# Altium project esp32_wled.PrjPcb
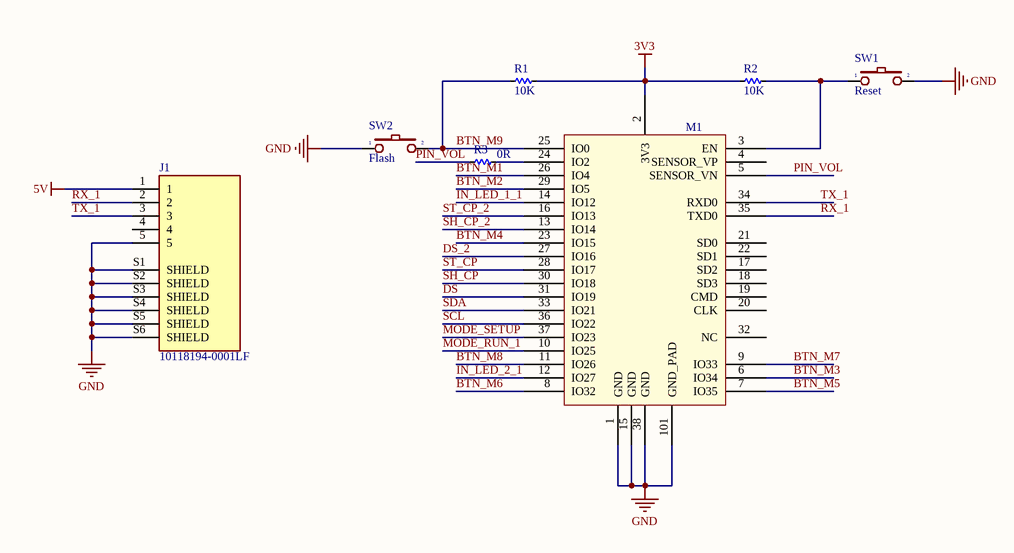
[diagram p0: [1]esp32.SchDoc]
5 sheets, 95 parts. Net scope: global (net labels, ports and power ports of the same name join across sheets).
Board file: esp32_wled.PcbDoc
Sheets:
  [1]esp32.SchDoc
  [2]Power.SchDoc
  [3]mic.SchDoc
  [4]Communicate.SchDoc
  [5]wled.SchDoc

## Sheet [1]esp32.SchDoc
size A4

### Parts
J1  10118194-0001LF  [AMPHENOL_10118194-0001LF]
M1  ESP32S_Module  [ESP32S]  (value not drawn)
R1  10K  [RES-SMD-0603]
R2  10K  [RES-SMD-0603]
R3  0R  [RES-SMD-0603]
SW1  Reset  [SW1-SMD]
SW2  Flash  [SW-DIP1-1]

### Nets
3V3: M1.2(3V3) R1.1 R2.2
5V: J1.1
GND: J1.5 J1.S1(SHIELD) J1.S2(SHIELD) J1.S3(SHIELD) J1.S4(SHIELD) J1.S5(SHIELD) J1.S6(SHIELD) M1.1(GND) M1.15(GND) M1.38(GND) M1.101(GND_PAD) SW1.2 SW2.1
BTN_M1: M1.26(IO4)
BTN_M2: M1.29(IO5)
BTN_M3: M1.6(IO34)
BTN_M4: M1.23(IO15)
BTN_M5: M1.7(IO35)
BTN_M6: M1.8(IO32)
BTN_M7: M1.9(IO33)
BTN_M8: M1.11(IO26)
BTN_M9: M1.25(IO0) R1.2 SW2.2
DS: M1.31(IO19)
DS_2: M1.27(IO16)
IN_LED_1_1: M1.14(IO12)
IN_LED_2_1: M1.12(IO27)
MODE_RUN_1: M1.10(IO25)
MODE_SETUP: M1.37(IO23)
PIN_VOL: M1.5(SENSOR_VN) R3.1
RX_1: J1.2 M1.35(TXD0)
SCL: M1.36(IO22)
SDA: M1.33(IO21)
SH_CP: M1.30(IO18)
SH_CP_2: M1.13(IO14)
ST_CP: M1.28(IO17)
ST_CP_2: M1.16(IO13)
TX_1: J1.3 M1.34(RXD0)
NetM1_3: M1.3(EN) R2.1 SW1.1
NetM1_24: M1.24(IO2) R3.2

Not connected (* = marked no-connect by the designer): J1 4; M1 4(SENSOR_VP) 17(SD2) 18(SD3) 19(CMD) 20(CLK) 21(SD0) 22(SD1) 32(NC)

### Library data of the parts
J1 = 10118194-0001LF: USB - micro B USB 2.0 Receptacle Connector 5 Position Surface Mount, Right Angle; Through Hole; MF: Amphenol ICC; Package: None; Price: None; Availability: Unavailable; MP: 10118194-0001LF; SnapEDA_Link: https://www.snapeda.com/parts/10118194-0001LF/Amphenol%20FCI/view-part/1413308/?ref=snap; Value: *
M1 = ESP32S_Module: Esp-32S; Datasheet: https://espressif.com/sites/default/files/documentation/esp_wroom_32_datasheet_en.pdf
R1-R3 = Res-SMD: Resistor; Manufacturer: Generic Components; Class: Passive; Published: 08/06/2000; Publisher: Altium Hobart Technology Centre
SW1 SW2 = SW2: Switch button 2 pin; Value: SW chip 2 pin

## Sheet [2]Power.SchDoc
size A
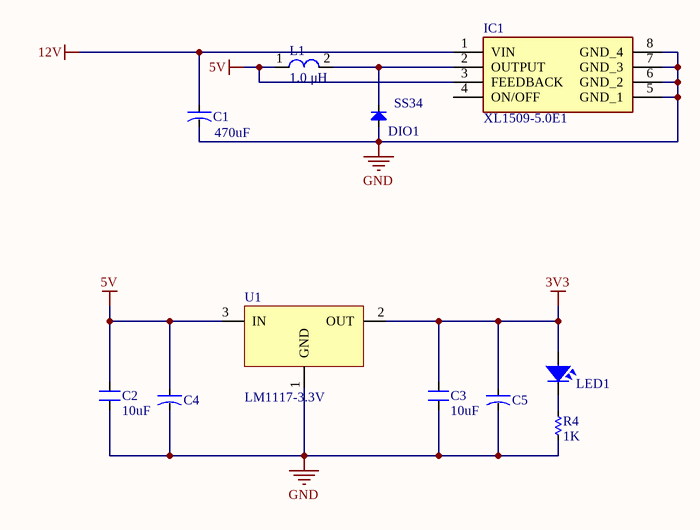
[diagram p1: [2]Power.SchDoc]

### Parts
C1  470uF  [CAP-ALU-SMD-6.3x7.7x2.2]
C2  10uF  [CN-SMD-0603]
C3  10uF  [CN-SMD-0603]
C4  CN-ALU-SMD  [CAP-ALU-SMD-4.5x5x1.4]  (value not drawn)
C5  CN-ALU-SMD  [CAP-ALU-SMD-4.5x5x1.4]  (value not drawn)
DIO1  SS34  [DIO-SMD-106]
IC1  XL1509-5.0E1  [SOIC127P600X175-8N]
L1  1.0 μH  [L-SMD-M-7.3x4.5]
LED1  LED  [LED-0805-Blue]  (value not drawn)
R4  1K  [RES-SMD-0603]
U1  LM1117-3.3V  [SOT223]

### Nets
3V3: C3.1 C5.1 LED1.1 U1.2(OUT)
5V: C2.1 C4.1 IC1.3(FEEDBACK) L1.1 U1.3(IN)
12V: C1.1 IC1.1(VIN)
GND: C1.2 C2.2 C3.2 C4.2 C5.2 DIO1.1(A) IC1.5(GND_1) IC1.6(GND_2) IC1.7(GND_3) IC1.8(GND_4) R4.2 U1.1(GND)
NetDIO1_2: DIO1.2(K) IC1.2(OUTPUT) L1.2
NetLED1_2: LED1.2 R4.1

Not connected (* = marked no-connect by the designer): IC1 4(ON/OFF)

### Library data of the parts
C1 C4 C5 = CN-ALU-SMD: Polarized Capacitor (Axial); Published: 8-Jun-2000; LatestRevisionDate: 17-Jul-2002; LatestRevisionNote: Re-released for DXP Platform.; PackageReference: POLAR0.8; Publisher: Altium Limited
C2 C3 = CN: Tu gom; Value: 33pF
DIO1 = Diode SMD: Default Diode; Code - JEDEC: DO-214-AB; Value: 1N5007; Published: 8-Jun-2000; Revision: July-2002: Re-released for DXP Platform.; Publisher: Altium Limited
IC1 = XL1509-5.0E1: Integrated Circuit; Manufacturer_Name: XLSEMI; Datasheet Link: https://datasheet.lcsc.com/szlcsc/XLSEMI-XL1509-5-0E1_C61063.pdf; Height: 1.75mm; Manufacturer_Part_Number: XL1509-5.0E1
L1 = L-SMD-1: partNo: 78477010; Manufacturer: Wurth Elektronik; Inductance: 1.0 μH; ComponentLink1Description: Manufacturer; ComponentLink1URL: http://www.we-online.de; Created by: Baojun Chen; Created Date: Nov.2015; ComponentLink2Description: Datasheet; ComponentLink2URL: http://katalog.we-online.de/pbs/datasheet/78477010.pdf
LED1 = LED SMD: Value: LED 3 - 5 ly 2 Colour
R4 = Res-SMD: as R1 on sheet [1]esp32; Published: 08/06/2000; Publisher: Altium Hobart Technology Centre
U1 = LM1117: 800mA Low-Dropout Linear Regulator; Creator: Nguyen Ba Bien; Website: http://group3i.net

## Sheet [3]mic.SchDoc
size A
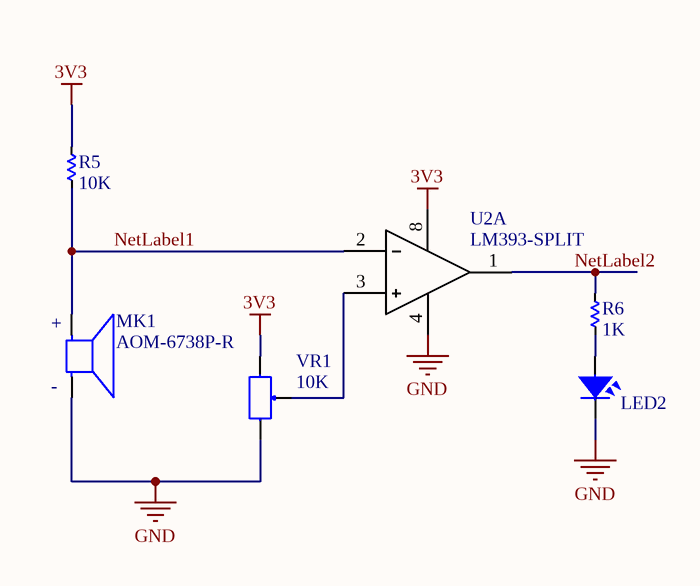
[diagram p2: [3]mic.SchDoc]

### Parts
LED2  LED  [LED-0805-Green]  (value not drawn)
MK1  AOM-6738P-R  [MIC_AOM-6738P-R]
R5  10K  [RES-SMD-0805]
R6  1K  [RES-SMD-0805]
U2  LM393-SPLIT  [SO8]  (part A of 2)
VR1  10K  [VR]

### Nets
3V3: R5.1 U2.8(Vcc+) VR1.1
GND: LED2.2 MK1.N(NEG) U2.4(Vcc-) VR1.3
NetLabel1: MK1.P(POS) R5.2 U2.2
NetLabel2: R6.1 U2.1
NetLED2_1: LED2.1 R6.2
NetU2_3: U2.3 VR1.2

### Notes on the sheet
- (in symbol AOM-6738P-R) +; -

### Library data of the parts
LED2 = LED SMD: Value: LED 3 - 5 ly 2 Colour
MK1 = AOM-6738P-R: MICROPHONE -38DB1.5VDC .5MA 2.2KOHM; MF: PUI; MP: AOM-6738P-R; SnapEDA_Link: https://www.snapeda.com/parts/AOM-6738P-R/PUI+Audio%252C+Inc./view-part/?ref=snap; Purchase-URL: https://pricing.snapeda.com/search/part/AOM-6738P-R/?ref=eda; Value: *; Package: None; Price: None; Availability: In Stock; Check_prices: https://www.snapeda.com/parts/AOM-6738P-R/PUI+Audio%252C+Inc./view-part/?ref=eda
R5 R6 = Res-SMD: as R1 on sheet [1]esp32; Published: 08/06/2000; Publisher: Altium Hobart Technology Centre
U2 = LM393-SPLIT: IC DUAL COMPARATOR; Supplier 1: Digi-Key; Supplier Part Number 1: LM393MXFSDKR-ND
VR1 = VR: Var Resistor; Value: VR 10K

## Sheet [4]Communicate.SchDoc
size A
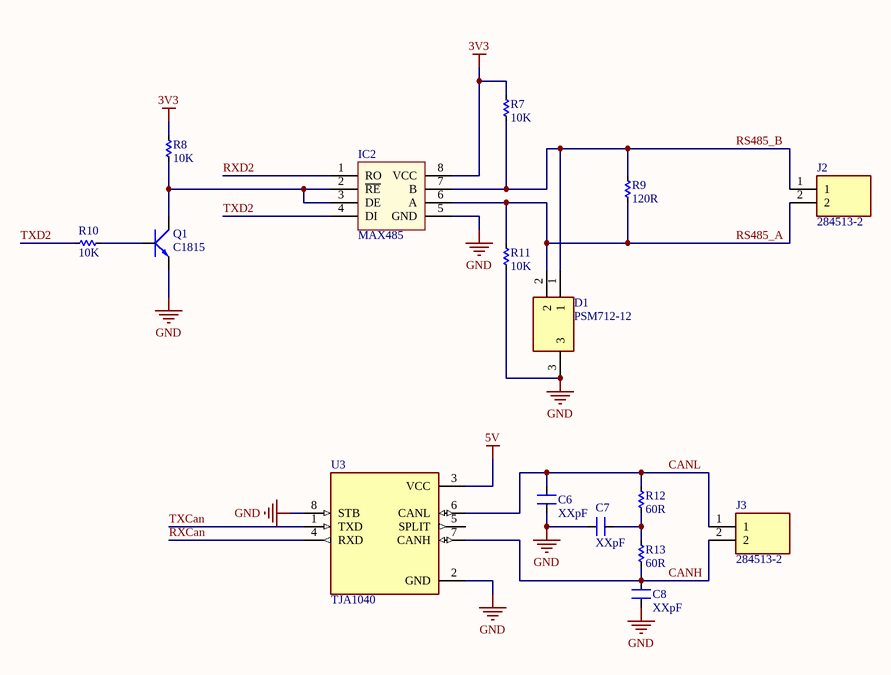
[diagram p3: [4]Communicate.SchDoc]

### Parts
C6  XXpF  [CN-SMD-0805]
C7  XXpF  [CN-SMD-0805]
C8  XXpF  [CN-SMD-0805]
D1  PSM712-12  [PSM71212]
IC2  MAX485  [SO8]
J2  284513-2  [SHDRRA2W80P0X381_1X2_863X920X730P]
J3  284513-2  [SHDRRA2W80P0X381_1X2_863X920X730P]
Q1  C1815  [SOT23B]
R7  10K  [RES-SMD-0805]
R8  10K  [RES-SMD-0805]
R9  120R  [RES-SMD-0805]
R10  10K  [RES-SMD-0805]
R11  10K  [RES-SMD-0805]
R12  60R  [RES-SMD-0805]
R13  60R  [RES-SMD-0805]
U3  TJA1040  [SOIC127P600X175-8N]

### Nets
3V3: IC2.8(VCC) R7.2 R8.2
5V: U3.3(VCC)
GND: C6.1 C7.1 C8.1 D1.3 IC2.5(GND) Q1.1(E) R11.1 U3.2(GND) U3.8(STB)
CANH: C8.2 J3.2 R13.2 U3.7(CANH)
CANL: C6.2 J3.1 R12.1 U3.6(CANL)
RS485_A: D1.2 IC2.6(A) J2.2 R9.1 R11.2
RS485_B: D1.1 IC2.7(B) J2.1 R7.1 R9.2
RXCan: U3.4(RXD)
RXD2: IC2.1(RO)
TXCan: U3.1(TXD)
TXD2: IC2.4(DI) R10.1
NetC7_2: C7.2 R12.2 R13.1
NetIC2_2: IC2.2(~{RE}) IC2.3(DE) Q1.2(C) R8.1
NetQ1_3: Q1.3(B) R10.2

Not connected (* = marked no-connect by the designer): U3 5(SPLIT)

### Library data of the parts
C6-C8 = CN: Value: 33pF
D1 = PSM712-12: TVS Diode (Bi-directional); Manufacturer_Name: ProTek Devices; Datasheet Link: http://www.protekdevices.com/xyz/documents/datasheets/psm712.pdf; Height: 1.21mm; Manufacturer_Part_Number: PSM712-12
IC2 = MAX485: RS232 - RS485 (Same sn75176)
J2 J3 = 284513-2: Connector; Manufacturer_Name: TE Connectivity; Datasheet Link: https://www.te.com/commerce/DocumentDelivery/DDEController?Action=showdoc&DocId=Catalog+Section%7F1308389_EUROSTYLE_TERMINAL_BLOCKS%7F0607%7Fpdf%7FEnglish%7FENG_CS_1308389_EUROSTYLE_TERMINAL_BLOCKS_0607.pdf%7F284513-2; Height: 7.3mm; Manufacturer_Part_Number: 284513-2; Mouser Part Number: 571-284513-2; Mouser Price/Stock: https://www.mouser.co.uk/ProductDetail/TE-Connectivity/284513-2?qs=woBvfblj%2FzzKKzHe5cbw%252BQ%3D%3D; Arrow Part Number: 284513-2; Arrow Price/Stock: https://www.arrow.com/en/products/284513-2/te-connectivity
Q1 = C1815: NPN 600mW, ECB; Value: C1815
R7-R13 = Res-SMD: as R1 on sheet [1]esp32; Published: 08/06/2000; Publisher: Altium Hobart Technology Centre
U3 = TJA1040: 1/1 Transceiver Half CANbus 8-SO; MF: NXP USA; Package: SOIC-8 NXP USA; SnapEDA_Link: https://www.snapeda.com/parts/TJA1040/NXP%20USA%20Inc./view-part/563351/?ref=snap; Price: None; Availability: Unavailable; MP: TJA1040; Value: *

## Sheet [5]wled.SchDoc
size A
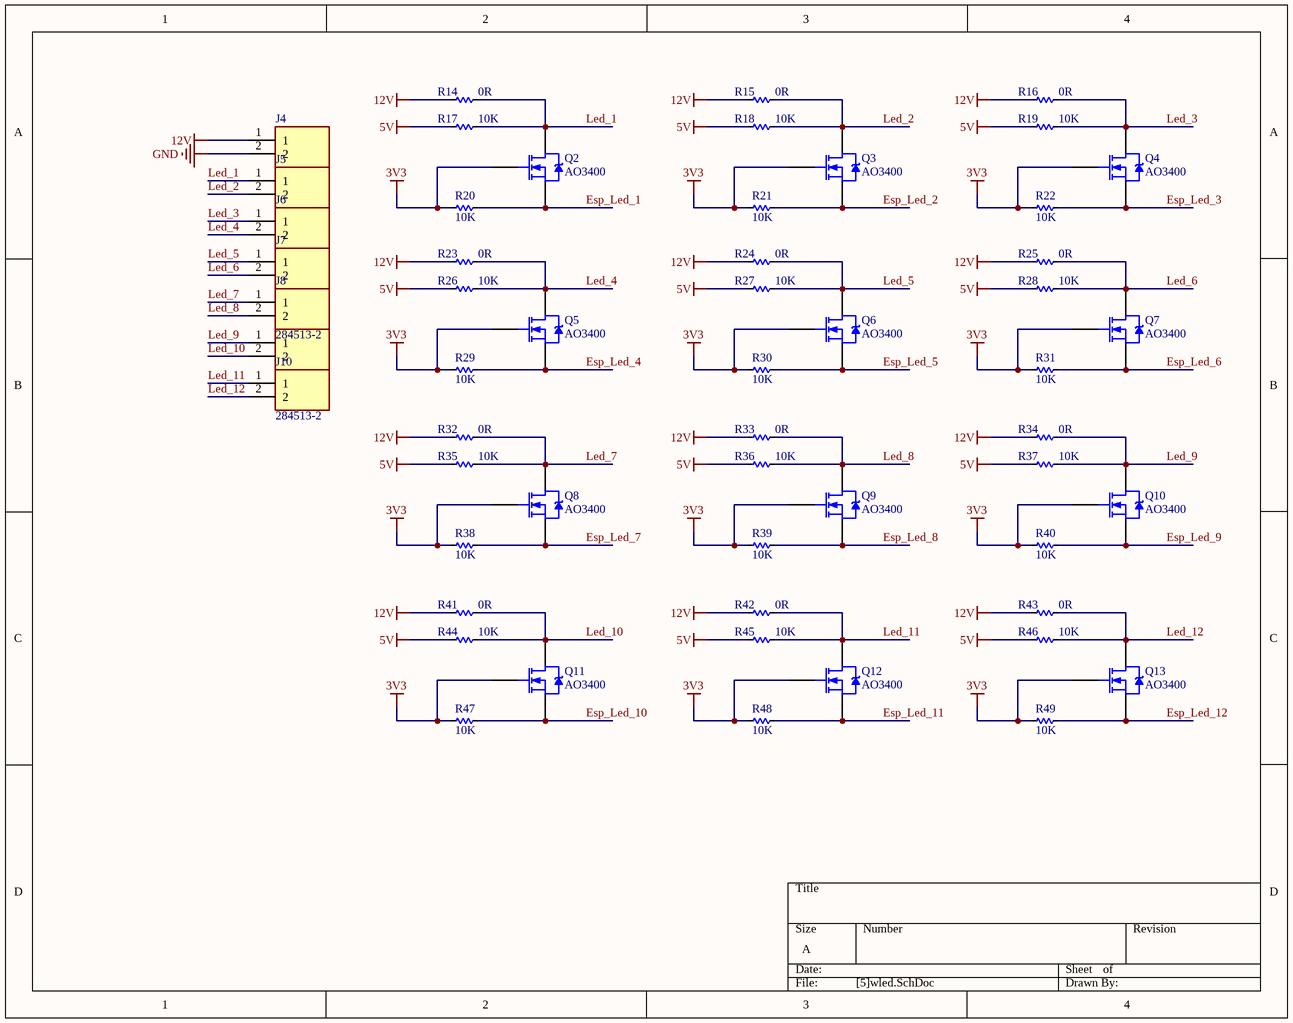
[diagram p4: [5]wled.SchDoc]

### Parts
J4  284513-2  [SHDRRA2W80P0X381_1X2_863X920X730P]
J5  284513-2  [SHDRRA2W80P0X381_1X2_863X920X730P]
J6  284513-2  [SHDRRA2W80P0X381_1X2_863X920X730P]
J7  284513-2  [SHDRRA2W80P0X381_1X2_863X920X730P]
J8  284513-2  [SHDRRA2W80P0X381_1X2_863X920X730P]
J9  284513-2  [SHDRRA2W80P0X381_1X2_863X920X730P]
J10  284513-2  [SHDRRA2W80P0X381_1X2_863X920X730P]
Q2  AO3400  [SOT-23_N]
Q3  AO3400  [SOT-23_N]
Q4  AO3400  [SOT-23_N]
Q5  AO3400  [SOT-23_N]
Q6  AO3400  [SOT-23_N]
Q7  AO3400  [SOT-23_N]
Q8  AO3400  [SOT-23_N]
Q9  AO3400  [SOT-23_N]
Q10  AO3400  [SOT-23_N]
Q11  AO3400  [SOT-23_N]
Q12  AO3400  [SOT-23_N]
Q13  AO3400  [SOT-23_N]
R14  0R  [RES-SMD-0805]
R15  0R  [RES-SMD-0805]
R16  0R  [RES-SMD-0805]
R17  10K  [RES-SMD-0805]
R18  10K  [RES-SMD-0805]
R19  10K  [RES-SMD-0805]
R20  10K  [RES-SMD-0805]
R21  10K  [RES-SMD-0805]
R22  10K  [RES-SMD-0805]
R23  0R  [RES-SMD-0805]
R24  0R  [RES-SMD-0805]
R25  0R  [RES-SMD-0805]
R26  10K  [RES-SMD-0805]
R27  10K  [RES-SMD-0805]
R28  10K  [RES-SMD-0805]
R29  10K  [RES-SMD-0805]
R30  10K  [RES-SMD-0805]
R31  10K  [RES-SMD-0805]
R32  0R  [RES-SMD-0805]
R33  0R  [RES-SMD-0805]
R34  0R  [RES-SMD-0805]
R35  10K  [RES-SMD-0805]
R36  10K  [RES-SMD-0805]
R37  10K  [RES-SMD-0805]
R38  10K  [RES-SMD-0805]
R39  10K  [RES-SMD-0805]
R40  10K  [RES-SMD-0805]
R41  0R  [RES-SMD-0805]
R42  0R  [RES-SMD-0805]
R43  0R  [RES-SMD-0805]
R44  10K  [RES-SMD-0805]
R45  10K  [RES-SMD-0805]
R46  10K  [RES-SMD-0805]
R47  10K  [RES-SMD-0805]
R48  10K  [RES-SMD-0805]
R49  10K  [RES-SMD-0805]

### Nets
3V3: Q2.1(G) Q3.1(G) Q4.1(G) Q5.1(G) Q6.1(G) Q7.1(G) Q8.1(G) Q9.1(G) Q10.1(G) Q11.1(G) Q12.1(G) Q13.1(G) R20.1 R21.1 R22.1 R29.1 R30.1 R31.1 R38.1 R39.1 R40.1 R47.1 R48.1 R49.1
5V: R17.1 R18.1 R19.1 R26.1 R27.1 R28.1 R35.1 R36.1 R37.1 R44.1 R45.1 R46.1
12V: J4.1 R14.1 R15.1 R16.1 R23.1 R24.1 R25.1 R32.1 R33.1 R34.1 R41.1 R42.1 R43.1
GND: J4.2
Esp_Led_1: Q2.2(S) R20.2
Esp_Led_2: Q3.2(S) R21.2
Esp_Led_3: Q4.2(S) R22.2
Esp_Led_4: Q5.2(S) R29.2
Esp_Led_5: Q6.2(S) R30.2
Esp_Led_6: Q7.2(S) R31.2
Esp_Led_7: Q8.2(S) R38.2
Esp_Led_8: Q9.2(S) R39.2
Esp_Led_9: Q10.2(S) R40.2
Esp_Led_10: Q11.2(S) R47.2
Esp_Led_11: Q12.2(S) R48.2
Esp_Led_12: Q13.2(S) R49.2
Led_1: J5.1 Q2.3(D) R14.2 R17.2
Led_2: J5.2 Q3.3(D) R15.2 R18.2
Led_3: J6.1 Q4.3(D) R16.2 R19.2
Led_4: J6.2 Q5.3(D) R23.2 R26.2
Led_5: J7.1 Q6.3(D) R24.2 R27.2
Led_6: J7.2 Q7.3(D) R25.2 R28.2
Led_7: J8.1 Q8.3(D) R32.2 R35.2
Led_8: J8.2 Q9.3(D) R33.2 R36.2
Led_9: J9.1 Q10.3(D) R34.2 R37.2
Led_10: J9.2 Q11.3(D) R41.2 R44.2
Led_11: J10.1 Q12.3(D) R42.2 R45.2
Led_12: J10.2 Q13.3(D) R43.2 R46.2

### Library data of the parts
J4-J10 = 284513-2: as J2 on sheet [4]Communicate; Datasheet Link: https://www.te.com/commerce/DocumentDelivery/DDEController?Action=showdoc&DocId=Catalog+Section%7F1308389_EUROSTYLE_TERMINAL_BLOCKS%7F0607%7Fpdf%7FEnglish%7FENG_CS_1308389_EUROSTYLE_TERMINAL_BLOCKS_0607.pdf%7F284513-2; Height: 7.3mm; Manufacturer_Part_Number: 284513-2; Mouser Part Number: 571-284513-2; Mouser Price/Stock: https://www.mouser.co.uk/ProductDetail/TE-Connectivity/284513-2?qs=woBvfblj%2FzzKKzHe5cbw%252BQ%3D%3D; Arrow Part Number: 284513-2; Arrow Price/Stock: https://www.arrow.com/en/products/284513-2/te-connectivity
Q2-Q13 = IRLML2402: HEXFET Power MOSFET; Published: 8-Jun-2000; LatestRevisionDate: 20-Nov-2009; LatestRevisionNote: IPC-7351 Footprint Added.; DatasheetVersion: Aug-1997; PackageReference: SOT-23; Publisher: Altium Limited; PackageDescription: 3-Pin SOT-23 Package 0.95 mm Pitch, 2.3 mm Lead Span; ComponentLink1Description: Manufacturer Link; ComponentLink1URL: http://www.irf.com/; ComponentLink2Description: Datasheet; ComponentLink2URL: http://www.irf.com/product-info/datasheets/data/irlml2402.pdf
R14-R49 = Res-SMD: as R1 on sheet [1]esp32; Published: 08/06/2000; Publisher: Altium Hobart Technology Centre

## Nets that join several sheets
3V3: [1]esp32 (M1.2 R1.1 R2.2), [2]Power (C3.1 C5.1 LED1.1 U1.2), [3]mic (R5.1 U2.8 VR1.1), [4]Communicate (IC2.8 R7.2 R8.2), [5]wled (24 pins)
5V: [1]esp32 (J1.1), [2]Power (5 pins), [4]Communicate (U3.3), [5]wled (12 pins)
12V: [2]Power (C1.1 IC1.1), [5]wled (13 pins)
GND: [1]esp32 (13 pins), [2]Power (12 pins), [3]mic (LED2.2 MK1.N U2.4 VR1.3), [4]Communicate (9 pins), [5]wled (J4.2)